# Altium schematic sheet top.SchDoc: Your title
size A4; Date: 2017/06/29; DrawnBy: ØÁÔÀöÎ; Revision: Alfa 0.1; SheetNumber: 1; SheetTotal: 6; Time: 19:01
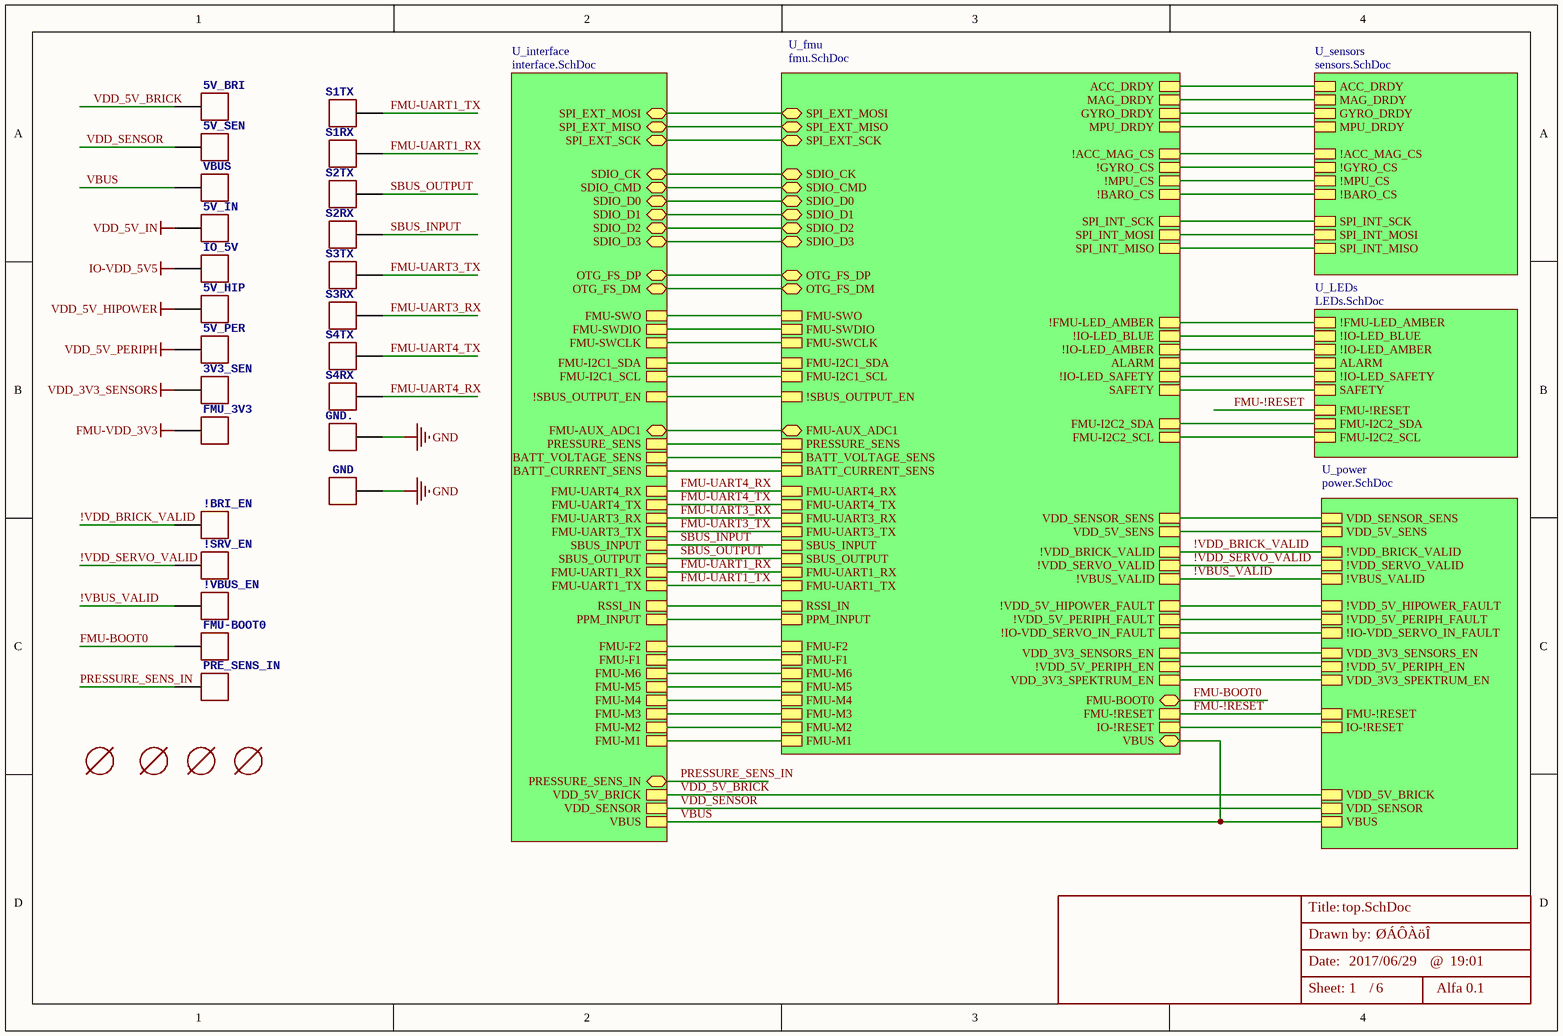
[diagram p0: top.SchDoc]

## Parts
3V3_SEN  PAD.04  [PAD.04X.04]  (value not drawn)
5V_BRI  PAD.04  [PAD.04X.04]  (value not drawn)
5V_HIP  PAD.04  [PAD.04X.04]  (value not drawn)
5V_IN  PAD.04  [PAD.04X.04]  (value not drawn)
5V_PER  PAD.04  [PAD.04X.04]  (value not drawn)
5V_SEN  PAD.04  [PAD.04X.04]  (value not drawn)
!BRI_EN  PAD.04  [PAD.04X.04]  (value not drawn)
!SRV_EN  PAD.04  [PAD.04X.04]  (value not drawn)
!VBUS_EN  PAD.04  [PAD.04X.04]  (value not drawn)
FMU-BOOT0  PAD.04  [PAD.04X.04]  (value not drawn)
FMU_3V3  PAD.04  [PAD.04X.04]  (value not drawn)
GND  PAD.04  [PAD.04X.04]  (value not drawn)
GND.  PAD.04  [PAD.04X.04]  (value not drawn)
IO_5V  PAD.04  [PAD.04X.04]  (value not drawn)
M100  MOUNT-HOLE1.8MM  [HOLE-3mm]  (value not drawn)
M101  MOUNT-HOLE1.8MM  [HOLE-3mm]  (value not drawn)
M102  MOUNT-HOLE1.8MM  [HOLE-3mm]  (value not drawn)
M103  MOUNT-HOLE1.8MM  [HOLE-3mm]  (value not drawn)
PRE_SENS_IN  PAD.04  [PAD.04X.04]  (value not drawn)
S1RX  PAD.04  [PAD.04X.04]  (value not drawn)
S1TX  PAD.04  [PAD.04X.04]  (value not drawn)
S2RX  PAD.04  [PAD.04X.04]  (value not drawn)
S2TX  PAD.04  [PAD.04X.04]  (value not drawn)
S3RX  PAD.04  [PAD.04X.04]  (value not drawn)
S3TX  PAD.04  [PAD.04X.04]  (value not drawn)
S4RX  PAD.04  [PAD.04X.04]  (value not drawn)
S4TX  PAD.04  [PAD.04X.04]  (value not drawn)
VBUS  PAD.04  [PAD.04X.04]  (value not drawn)

## Sub-sheets
U_fmu = fmu.SchDoc: FMU-M1, FMU-M2, FMU-M3, FMU-M4, FMU-M5, FMU-M6, FMU-F1, FMU-F2, PPM_INPUT, SBUS_INPUT, SBUS_OUTPUT, !SBUS_OUTPUT_EN, RSSI_IN, FMU-UART1_TX, FMU-UART1_RX, FMU-UART3_TX, FMU-UART3_RX, FMU-UART4_TX, FMU-UART4_RX, BATT_CURRENT_SENS, BATT_VOLTAGE_SENS, PRESSURE_SENS, FMU-I2C1_SCL, FMU-I2C1_SDA, FMU-SWCLK, FMU-SWDIO, FMU-SWO, !VDD_BRICK_VALID, !VDD_SERVO_VALID, !VBUS_VALID, VDD_SENSOR_SENS, VDD_3V3_SENSORS_EN, FMU-!RESET, !VDD_5V_HIPOWER_FAULT, !VDD_5V_PERIPH_FAULT, VDD_5V_SENS, !VDD_5V_PERIPH_EN, VDD_3V3_SPEKTRUM_EN, IO-!RESET, GYRO_DRDY, ACC_DRDY, MAG_DRDY, MPU_DRDY, !GYRO_CS, !ACC_MAG_CS, !MPU_CS, !BARO_CS, SPI_INT_SCK, SPI_INT_MOSI, SPI_INT_MISO, !FMU-LED_AMBER, !IO-LED_BLUE, !IO-LED_AMBER, FMU-I2C2_SDA, FMU-I2C2_SCL, !IO-LED_SAFETY, SAFETY, OTG_FS_DP, OTG_FS_DM, !IO-VDD_SERVO_IN_FAULT, FMU-AUX_ADC1, VBUS, ALARM, SDIO_CK, SDIO_CMD, SDIO_D0, SDIO_D1, SDIO_D2, SDIO_D3, SPI_EXT_MOSI, SPI_EXT_MISO, SPI_EXT_SCK, FMU-BOOT0
U_interface = interface.SchDoc: FMU-M1, FMU-M2, FMU-M3, FMU-M4, FMU-M5, FMU-M6, FMU-F1, FMU-F2, PPM_INPUT, SBUS_INPUT, SBUS_OUTPUT, !SBUS_OUTPUT_EN, RSSI_IN, FMU-UART1_TX, FMU-UART1_RX, FMU-UART3_TX, FMU-UART3_RX, FMU-UART4_TX, FMU-UART4_RX, VDD_SENSOR, VDD_5V_BRICK, BATT_CURRENT_SENS, BATT_VOLTAGE_SENS, PRESSURE_SENS, FMU-I2C1_SCL, FMU-I2C1_SDA, FMU-SWCLK, FMU-SWDIO, FMU-SWO, VBUS, OTG_FS_DP, OTG_FS_DM, SDIO_CK, SDIO_CMD, SDIO_D0, SDIO_D1, SDIO_D2, SDIO_D3, SPI_EXT_MOSI, SPI_EXT_MISO, SPI_EXT_SCK, FMU-AUX_ADC1, PRESSURE_SENS_IN
U_LEDs = LEDs.SchDoc: !FMU-LED_AMBER, !IO-LED_BLUE, !IO-LED_AMBER, ALARM, FMU-I2C2_SDA, FMU-I2C2_SCL, FMU-!RESET, !IO-LED_SAFETY, SAFETY
U_power = power.SchDoc: VBUS, VDD_5V_BRICK, VDD_SENSOR, !VDD_BRICK_VALID, !VDD_SERVO_VALID, !VBUS_VALID, VDD_SENSOR_SENS, VDD_3V3_SENSORS_EN, FMU-!RESET, !VDD_5V_HIPOWER_FAULT, !VDD_5V_PERIPH_FAULT, VDD_5V_SENS, !VDD_5V_PERIPH_EN, !IO-VDD_SERVO_IN_FAULT, VDD_3V3_SPEKTRUM_EN, IO-!RESET
U_sensors = sensors.SchDoc: GYRO_DRDY, ACC_DRDY, MAG_DRDY, MPU_DRDY, !GYRO_CS, !ACC_MAG_CS, !MPU_CS, !BARO_CS, SPI_INT_SCK, SPI_INT_MOSI, SPI_INT_MISO

## Nets
FMU-VDD_3V3: FMU_3V3.P$1
GND: GND.P$1 GND..P$1
IO-VDD_5V5: IO_5V.P$1
VDD_3V3_SENSORS: 3V3_SEN.P$1
VDD_5V_HIPOWER: 5V_HIP.P$1
VDD_5V_IN: 5V_IN.P$1
VDD_5V_PERIPH: 5V_PER.P$1
!VBUS_VALID: !VBUS_EN.P$1 ; sheet U_fmu/!VBUS_VALID, sheet U_power/!VBUS_VALID
!VDD_BRICK_VALID: !BRI_EN.P$1 ; sheet U_fmu/!VDD_BRICK_VALID, sheet U_power/!VDD_BRICK_VALID
!VDD_SERVO_VALID: !SRV_EN.P$1 ; sheet U_fmu/!VDD_SERVO_VALID, sheet U_power/!VDD_SERVO_VALID
FMU-!RESET: sheet U_fmu/FMU-!RESET, sheet U_LEDs/FMU-!RESET, sheet U_power/FMU-!RESET
FMU-BOOT0: FMU-BOOT0.P$1 ; sheet U_fmu/FMU-BOOT0
FMU-UART1_RX: S1RX.P$1 ; sheet U_interface/FMU-UART1_RX, sheet U_fmu/FMU-UART1_RX
FMU-UART1_TX: S1TX.P$1 ; sheet U_interface/FMU-UART1_TX, sheet U_fmu/FMU-UART1_TX
FMU-UART3_RX: S3RX.P$1 ; sheet U_interface/FMU-UART3_RX, sheet U_fmu/FMU-UART3_RX
FMU-UART3_TX: S3TX.P$1 ; sheet U_interface/FMU-UART3_TX, sheet U_fmu/FMU-UART3_TX
FMU-UART4_RX: S4RX.P$1 ; sheet U_interface/FMU-UART4_RX, sheet U_fmu/FMU-UART4_RX
FMU-UART4_TX: S4TX.P$1 ; sheet U_interface/FMU-UART4_TX, sheet U_fmu/FMU-UART4_TX
PRESSURE_SENS_IN: PRE_SENS_IN.P$1 ; sheet U_interface/PRESSURE_SENS_IN
SBUS_INPUT: S2RX.P$1 ; sheet U_interface/SBUS_INPUT, sheet U_fmu/SBUS_INPUT
SBUS_OUTPUT: S2TX.P$1 ; sheet U_interface/SBUS_OUTPUT, sheet U_fmu/SBUS_OUTPUT
VBUS: VBUS.P$1 ; sheet U_interface/VBUS, sheet U_fmu/VBUS, sheet U_power/VBUS
VDD_5V_BRICK: 5V_BRI.P$1 ; sheet U_interface/VDD_5V_BRICK, sheet U_power/VDD_5V_BRICK
VDD_SENSOR: 5V_SEN.P$1 ; sheet U_interface/VDD_SENSOR, sheet U_power/VDD_SENSOR
(unnamed): sheet U_interface/FMU-M1, sheet U_fmu/FMU-M1
(unnamed): sheet U_interface/FMU-M2, sheet U_fmu/FMU-M2
(unnamed): sheet U_interface/FMU-M3, sheet U_fmu/FMU-M3
(unnamed): sheet U_interface/FMU-M4, sheet U_fmu/FMU-M4
(unnamed): sheet U_interface/FMU-M5, sheet U_fmu/FMU-M5
(unnamed): sheet U_interface/FMU-M6, sheet U_fmu/FMU-M6
(unnamed): sheet U_interface/FMU-F1, sheet U_fmu/FMU-F1
(unnamed): sheet U_interface/FMU-F2, sheet U_fmu/FMU-F2
(unnamed): sheet U_interface/PPM_INPUT, sheet U_fmu/PPM_INPUT
(unnamed): sheet U_interface/!SBUS_OUTPUT_EN, sheet U_fmu/!SBUS_OUTPUT_EN
(unnamed): sheet U_interface/RSSI_IN, sheet U_fmu/RSSI_IN
(unnamed): sheet U_interface/BATT_CURRENT_SENS, sheet U_fmu/BATT_CURRENT_SENS
(unnamed): sheet U_interface/BATT_VOLTAGE_SENS, sheet U_fmu/BATT_VOLTAGE_SENS
(unnamed): sheet U_interface/PRESSURE_SENS, sheet U_fmu/PRESSURE_SENS
(unnamed): sheet U_interface/FMU-I2C1_SCL, sheet U_fmu/FMU-I2C1_SCL
(unnamed): sheet U_interface/FMU-I2C1_SDA, sheet U_fmu/FMU-I2C1_SDA
(unnamed): sheet U_interface/FMU-SWCLK, sheet U_fmu/FMU-SWCLK
(unnamed): sheet U_interface/FMU-SWDIO, sheet U_fmu/FMU-SWDIO
(unnamed): sheet U_interface/FMU-SWO, sheet U_fmu/FMU-SWO
(unnamed): sheet U_interface/OTG_FS_DP, sheet U_fmu/OTG_FS_DP
(unnamed): sheet U_interface/OTG_FS_DM, sheet U_fmu/OTG_FS_DM
(unnamed): sheet U_interface/SDIO_CK, sheet U_fmu/SDIO_CK
(unnamed): sheet U_interface/SDIO_CMD, sheet U_fmu/SDIO_CMD
(unnamed): sheet U_interface/SDIO_D0, sheet U_fmu/SDIO_D0
(unnamed): sheet U_interface/SDIO_D1, sheet U_fmu/SDIO_D1
(unnamed): sheet U_interface/SDIO_D2, sheet U_fmu/SDIO_D2
(unnamed): sheet U_interface/SDIO_D3, sheet U_fmu/SDIO_D3
(unnamed): sheet U_interface/SPI_EXT_MOSI, sheet U_fmu/SPI_EXT_MOSI
(unnamed): sheet U_interface/SPI_EXT_MISO, sheet U_fmu/SPI_EXT_MISO
(unnamed): sheet U_interface/SPI_EXT_SCK, sheet U_fmu/SPI_EXT_SCK
(unnamed): sheet U_interface/FMU-AUX_ADC1, sheet U_fmu/FMU-AUX_ADC1
(unnamed): sheet U_fmu/VDD_SENSOR_SENS, sheet U_power/VDD_SENSOR_SENS
(unnamed): sheet U_fmu/VDD_3V3_SENSORS_EN, sheet U_power/VDD_3V3_SENSORS_EN
(unnamed): sheet U_fmu/!VDD_5V_HIPOWER_FAULT, sheet U_power/!VDD_5V_HIPOWER_FAULT
(unnamed): sheet U_fmu/!VDD_5V_PERIPH_FAULT, sheet U_power/!VDD_5V_PERIPH_FAULT
(unnamed): sheet U_fmu/VDD_5V_SENS, sheet U_power/VDD_5V_SENS
(unnamed): sheet U_fmu/!VDD_5V_PERIPH_EN, sheet U_power/!VDD_5V_PERIPH_EN
(unnamed): sheet U_fmu/VDD_3V3_SPEKTRUM_EN, sheet U_power/VDD_3V3_SPEKTRUM_EN
(unnamed): sheet U_fmu/IO-!RESET, sheet U_power/IO-!RESET
(unnamed): sheet U_fmu/GYRO_DRDY, sheet U_sensors/GYRO_DRDY
(unnamed): sheet U_fmu/ACC_DRDY, sheet U_sensors/ACC_DRDY
(unnamed): sheet U_fmu/MAG_DRDY, sheet U_sensors/MAG_DRDY
(unnamed): sheet U_fmu/MPU_DRDY, sheet U_sensors/MPU_DRDY
(unnamed): sheet U_fmu/!GYRO_CS, sheet U_sensors/!GYRO_CS
(unnamed): sheet U_fmu/!ACC_MAG_CS, sheet U_sensors/!ACC_MAG_CS
(unnamed): sheet U_fmu/!MPU_CS, sheet U_sensors/!MPU_CS
(unnamed): sheet U_fmu/!BARO_CS, sheet U_sensors/!BARO_CS
(unnamed): sheet U_fmu/SPI_INT_SCK, sheet U_sensors/SPI_INT_SCK
(unnamed): sheet U_fmu/SPI_INT_MOSI, sheet U_sensors/SPI_INT_MOSI
(unnamed): sheet U_fmu/SPI_INT_MISO, sheet U_sensors/SPI_INT_MISO
(unnamed): sheet U_fmu/!FMU-LED_AMBER, sheet U_LEDs/!FMU-LED_AMBER
(unnamed): sheet U_fmu/!IO-LED_BLUE, sheet U_LEDs/!IO-LED_BLUE
(unnamed): sheet U_fmu/!IO-LED_AMBER, sheet U_LEDs/!IO-LED_AMBER
(unnamed): sheet U_fmu/FMU-I2C2_SDA, sheet U_LEDs/FMU-I2C2_SDA
(unnamed): sheet U_fmu/FMU-I2C2_SCL, sheet U_LEDs/FMU-I2C2_SCL
(unnamed): sheet U_fmu/!IO-LED_SAFETY, sheet U_LEDs/!IO-LED_SAFETY
(unnamed): sheet U_fmu/SAFETY, sheet U_LEDs/SAFETY
(unnamed): sheet U_fmu/!IO-VDD_SERVO_IN_FAULT, sheet U_power/!IO-VDD_SERVO_IN_FAULT
(unnamed): sheet U_fmu/ALARM, sheet U_LEDs/ALARM

## Notes on the sheet
- Title:
- Date:
- Drawn by:
- @
- Sheet:       /

## Library data of the parts
3V3_SEN = PAD.04: VDD_3V3_SENSORS; BOM: EXCLUDE; PARTNO: *
5V_BRI = PAD.04: VDD_5V_BRICK; BOM: EXCLUDE; PARTNO: *
5V_HIP = PAD.04: VDD_5V_HIPOWER; BOM: EXCLUDE; PARTNO: *
5V_IN = PAD.04: VDD_5V_IN; BOM: EXCLUDE; PARTNO: *
5V_PER = PAD.04: VDD_5V_PERIPH; BOM: EXCLUDE; PARTNO: *
5V_SEN = PAD.04: VDD_SENSOR; BOM: EXCLUDE; PARTNO: *
!BRI_EN = PAD.04: !VDD_BRICK_VALID; BOM: EXCLUDE; PARTNO: *
!SRV_EN = PAD.04: !VDD_SERVO_VALID; BOM: EXCLUDE; PARTNO: *
!VBUS_EN = PAD.04: !VBUS_VALID; BOM: EXCLUDE; PARTNO: *
FMU-BOOT0 GND GND. S1RX S1TX S2RX S2TX S3RX S3TX S4RX S4TX VBUS = PAD.04: BOM: EXCLUDE; PARTNO: *
FMU_3V3 = PAD.04: FMU-VDD_3V3; BOM: EXCLUDE; PARTNO: *
IO_5V = PAD.04: IO-VDD_5V5; BOM: EXCLUDE; PARTNO: *
M100-M103 = MOUNT-HOLE1.8MM: BOM: EXCLUDE; PARTNO: *
PRE_SENS_IN = PAD.04: PRESSURE_SENS_IN; BOM: EXCLUDE; PARTNO: *